# EAGLE schematic esp (EAGLE 9.6.2)
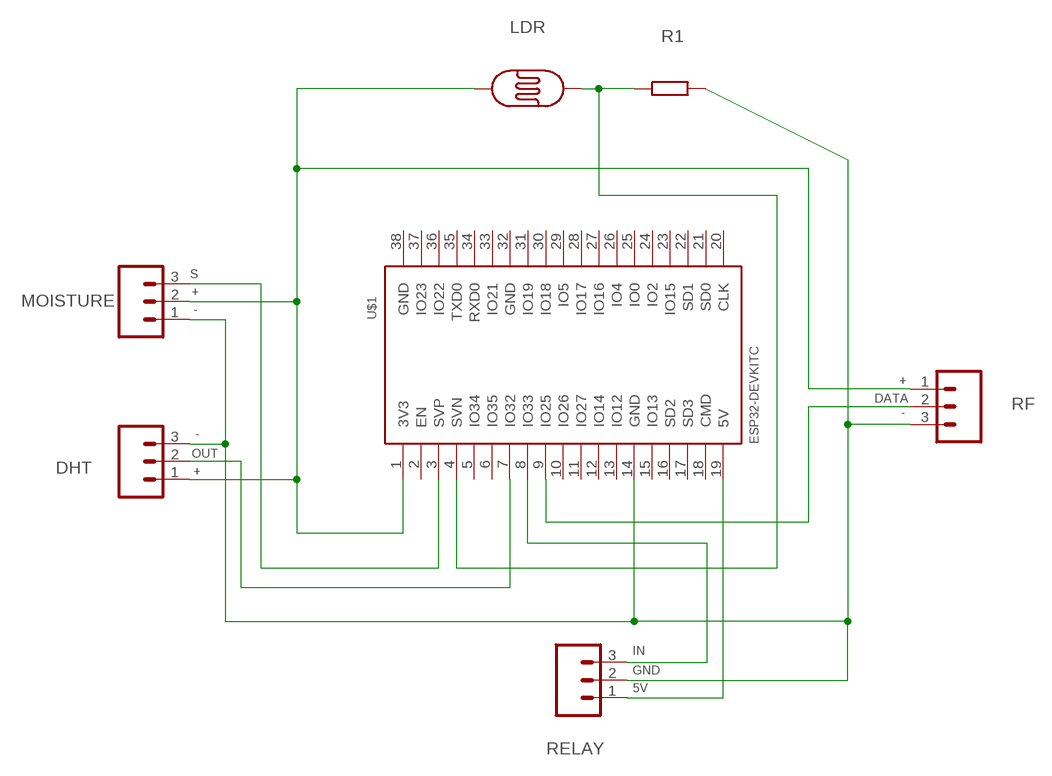
[diagram p0: schematic, sheet 1]

## Parts
DHT  455-1750-1-ND  CONN_03  [1X03]
LDR  PHOTOCELLPTH  [PHOTOCELL]
MOISTURE  455-1750-1-ND  CONN_03  [1X03]
R1  R-EU_0207/10  [0207/10]
RELAY  455-1750-1-ND  CONN_03  [1X03]
RF  455-1750-1-ND  CONN_03  [1X03]
U$1  ESP32DEVKITC  [ESP32-DEVKITC]
U$2  RELAY  [RELAY]  (not placed on a sheet)

## Nets
N$1: DHT.1 LDR.1 MOISTURE.2 RF.1 U$1.1(3V3)
N$2: LDR.2 R1.1 U$1.4(SVN)
N$3: DHT.3 MOISTURE.1 R1.2 RELAY.2 RF.3 U$1.14(GND)
N$4: MOISTURE.3 U$1.3(SVP)
N$5: DHT.2 U$1.7(IO32)
N$6: RELAY.1 U$1.19(5V)
N$7: RELAY.3 U$1.8(IO33)
N$9: RF.2 U$1.9(IO25)
Unconnected: U$1.2(EN) U$1.5(IO34) U$1.6(IO35) U$1.10(IO26) U$1.11(IO27) U$1.12(IO14) U$1.13(IO12) U$1.15(IO13) U$1.16(SD2) U$1.17(SD3) U$1.18(CMD) U$1.20(CLK) U$1.21(SD0) U$1.22(SD1) U$1.23(IO15) U$1.24(IO2) U$1.25(IO0) U$1.26(IO4) U$1.27(IO16) U$1.28(IO17) U$1.29(IO5) U$1.30(IO18) U$1.31(IO19) U$1.32(GND) U$1.33(IO21) U$1.34(RXD0) U$1.35(TXD0) U$1.36(IO22) U$1.37(IO23) U$1.38(GND)

## Notes on the sheet
- S
- +
- -
- +
- DATA
- -
- -
- OUT
- +
- IN
- GND
- 5V

## Library data of the parts
DHT MOISTURE RELAY RF = SparkFun-Connectors:CONN_03: Multi connection point. Often used as Generic Header-pin footprint for 0.1 inch spaced/style header connections On any of the 0.1 inch spaced packages, you can populate with these: Break Away Headers - Straight <https://www.sparkfun.com/products/116> (PRT-00116) Break Away Male Headers - Right Angle <https://www.sparkfun.com/products/553> (PRT-00553) Female Headers <https://www.sparkfun.com/products/115> (PRT-00115) Break Away Headers - Machine Pin <https://www.sparkfun.com/products/117> (PRT-00117) Break Away Female Headers - Swiss Machine Pin <https://www.sparkfun.com/products/743> (PRT-00743) Stackable Header - 3 Pin (Female, 0.1") <https://www.sparkfun.com/products/13875> (PRT-13875) For SCREWTERMINALS and SPRING TERMINALS visit here: Screw Terimnals on SparkFun.com <https://www.sparkfun.com/search/results?term=Screw+Terminals> (5mm/3.5mm/2.54mm spacing) This device is also useful as a general connection point to wire up your design to another part of your project. Our various solder wires solder well into these plated through hole pads. Hook-Up Wire - Assortment (Stranded, 22 AWG) <https://www.sparkfun.com/products/11375> (PRT-11375) Hook-Up Wire - Assortment (Solid Core, 22 AWG) <https://www.sparkfun.com/products/11367> (PRT-11367) View the entire wire category on our website here <https://www.sparkfun.com/categories/141> Special notes: Molex polarized connector foot print use with SKU : PRT-08232 with associated crimp pins and housings.; PROD_ID: XXX-00000
LDR = SparkFun-Sensors:PHOTOCELL: Photocell (Photodetector, Photo Resistor, CdS) This is a very small light sensor. A photocell changes (also called a photodetector, photo resistor, CdS or photoconductive cell) resistance depending on the amount of light it is exposed to. These little sensors make great ambient light triggers (when light in the room turns on, do something). Datasheet <http://cdn.sparkfun.com/datasheets/Sensors/LightImaging/SEN-09088.pdf> SparkFun Products Mini Photocell <https://www.sparkfun.com/products/9088> (SEN-09088); PROD_ID: COMP-09129; SF_ID: SEN-09088
R1 = rcl:R-EU_: RESISTOR, European symbol; SPICEPREFIX: R
U$1 = ESP32-DEVKITC_1000mil:ESP32DEVKITC
U$2 = Relay:RELAY